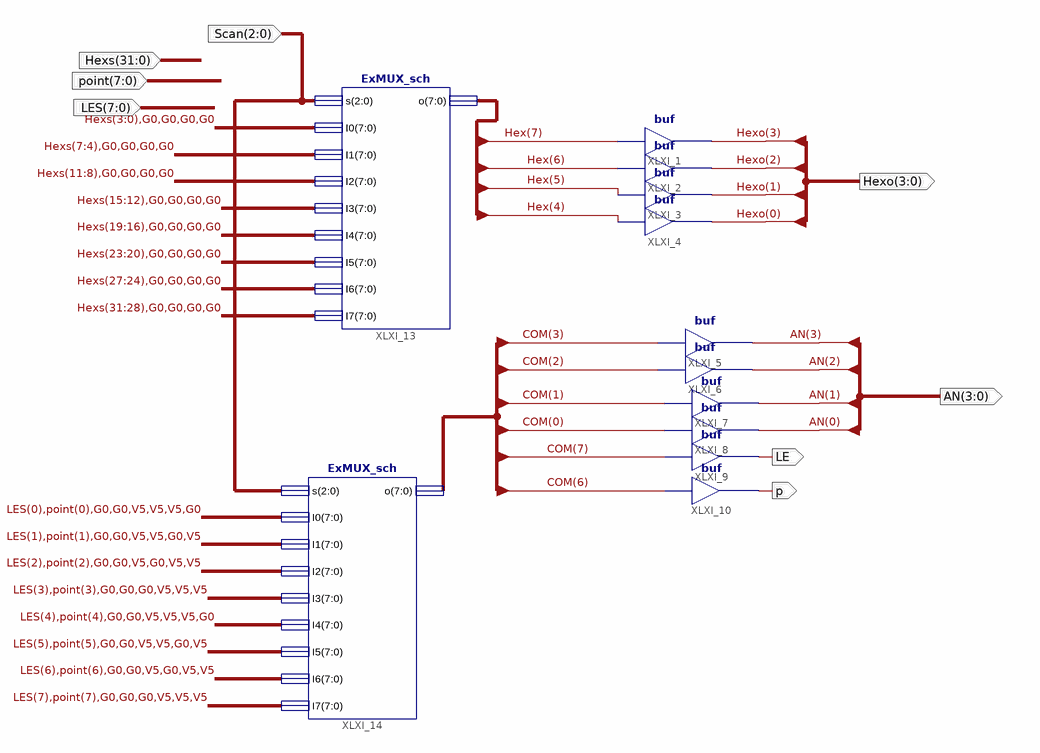
[diagram p0: schematic sheet 1]
// Xilinx ISE schematic ScanSync.sch (kintex7) as structural Verilog: 12 symbols, 8 ports
module ScanSync (
  input  [7:0] point,
  input  [31:0] Hexs,
  input  [7:0] LES,
  input  [2:0] Scan,
  output [3:0] Hexo,
  output [3:0] AN,
  output LE,
  output p
);

  wire G0, V5;
  wire [7:0] COM, Hex;

  buf XLXI_1 (Hexo[3], Hex[7]);
  buf XLXI_2 (Hexo[2], Hex[6]);
  buf XLXI_3 (Hexo[1], Hex[5]);
  buf XLXI_4 (Hexo[0], Hex[4]);
  buf XLXI_5 (AN[3], COM[3]);
  buf XLXI_6 (AN[2], COM[2]);
  buf XLXI_7 (AN[1], COM[1]);
  buf XLXI_8 (AN[0], COM[0]);
  buf XLXI_9 (LE, COM[7]);
  buf XLXI_10 (p, COM[6]);
  ExMUX_sch XLXI_13 (
    .s(Scan), .I0({Hexs[3:0], {4{G0}}}), .I1({Hexs[7:4], {4{G0}}}), .I2({Hexs[11:8], {4{G0}}}),
    .I3({Hexs[15:12], {4{G0}}}), .I4({Hexs[19:16], {4{G0}}}), .I5({Hexs[23:20], {4{G0}}}),
    .I6({Hexs[27:24], {4{G0}}}), .I7({Hexs[31:28], {4{G0}}}), .o(Hex));
  ExMUX_sch XLXI_14 (
    .s(Scan), .I0({LES[0], point[0], {2{G0}}, {3{V5}}, G0}),
    .I1({LES[1], point[1], {2{G0}}, {2{V5}}, G0, V5}), .I2({LES[2], point[2], {2{G0}}, V5, G0, {2{V5}}}),
    .I3({LES[3], point[3], {3{G0}}, {3{V5}}}), .I4({LES[4], point[4], {2{G0}}, {3{V5}}, G0}),
    .I5({LES[5], point[5], {2{G0}}, {2{V5}}, G0, V5}), .I6({LES[6], point[6], {2{G0}}, V5, G0, {2{V5}}}),
    .I7({LES[7], point[7], {3{G0}}, {3{V5}}}), .o(COM));
endmodule
